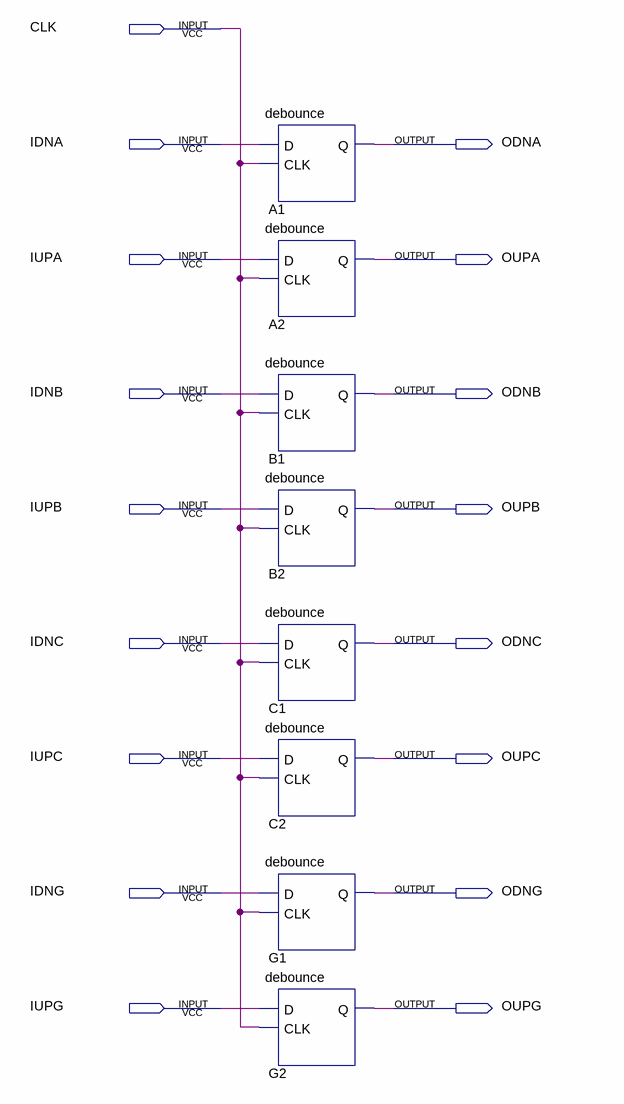
[diagram p0: schematic sheet]
// Quartus schematic modulo_debounce.bdf as structural Verilog: 8 symbols, 17 pins
module modulo_debounce (
  input  CLK,
  input  IDNA,
  input  IUPA,
  input  IDNB,
  input  IUPB,
  input  IDNC,
  input  IUPC,
  input  IDNG,
  input  IUPG,
  output ODNA,
  output OUPA,
  output ODNB,
  output OUPB,
  output ODNC,
  output OUPC,
  output ODNG,
  output OUPG
);

  debounce A1 (.D(IDNA), .CLK(CLK), .Q(ODNA));
  debounce A2 (.D(IUPA), .CLK(CLK), .Q(OUPA));
  debounce B1 (.D(IDNB), .CLK(CLK), .Q(ODNB));
  debounce B2 (.D(IUPB), .CLK(CLK), .Q(OUPB));
  debounce C1 (.D(IDNC), .CLK(CLK), .Q(ODNC));
  debounce C2 (.D(IUPC), .CLK(CLK), .Q(OUPC));
  debounce G1 (.D(IDNG), .CLK(CLK), .Q(ODNG));
  debounce G2 (.D(IUPG), .CLK(CLK), .Q(OUPG));
endmodule
